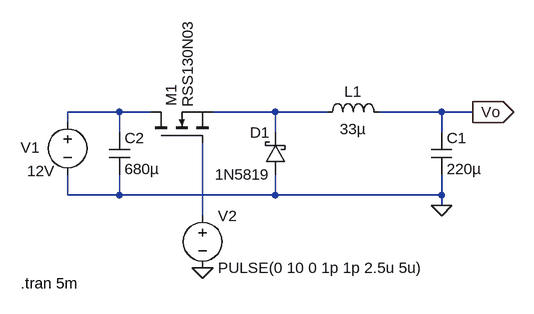
[diagram p0: schematic Open_Loop_Buck_Converter.asc]
Open_Loop_Buck_Converter.asc, the LTspice schematic file:
Version 4
SHEET 1 880 680
WIRE 112 112 32 112
WIRE 160 112 112 112
WIRE 352 112 256 112
WIRE 432 112 352 112
WIRE 608 112 512 112
WIRE 656 112 608 112
WIRE 32 128 32 112
WIRE 112 144 112 112
WIRE 352 144 352 112
WIRE 608 144 608 112
WIRE 32 240 32 208
WIRE 112 240 112 208
WIRE 112 240 32 240
WIRE 352 240 352 208
WIRE 352 240 112 240
WIRE 608 240 608 208
WIRE 608 240 352 240
WIRE 608 256 608 240
WIRE 240 272 240 160
FLAG 240 352 0
FLAG 656 112 Vo
IOPIN 656 112 Out
FLAG 608 256 0
SYMBOL ind 416 128 R270
WINDOW 0 32 56 VTop 2
WINDOW 3 5 56 VBottom 2
SYMATTR InstName L1
SYMATTR Value 33µ
SYMBOL cap 592 144 R0
SYMATTR InstName C1
SYMATTR Value 220µ
SYMBOL schottky 368 208 R180
WINDOW 0 24 64 Left 2
WINDOW 3 24 0 Left 2
SYMATTR InstName D1
SYMATTR Value 1N5819
SYMATTR Description Diode
SYMATTR Type diode
SYMBOL nmos 160 160 R270
WINDOW 3 55 57 Left 2
SYMATTR Value RSS130N03
SYMATTR InstName M1
SYMBOL voltage 32 112 R0
WINDOW 0 -72 55 Left 2
WINDOW 3 -62 91 Left 2
WINDOW 123 0 0 Left 0
WINDOW 39 0 0 Left 0
SYMATTR InstName V1
SYMATTR Value 12V
SYMBOL voltage 240 256 R0
WINDOW 123 0 0 Left 0
WINDOW 39 0 0 Left 0
SYMATTR InstName V2
SYMATTR Value PULSE(0 10 0 1p 1p 2.5u 5u)
SYMBOL cap 96 144 R0
SYMATTR InstName C2
SYMATTR Value 680µ
TEXT -40 376 Left 2 !.tran 5m

The netlist it stands for:
* Open_Loop_Buck_Converter.asc
L1 N002 Vo 33µ
C1 Vo 0 220µ
D1 0 N002 1N5819
M1 N001 N003 N002 N002 RSS130N03
V1 N001 0 12V
V2 N003 0 PULSE(0 10 0 1p 1p 2.5u 5u)
C2 N001 0 680µ
.model D D
.lib standard.dio
.model NMOS NMOS
.model PMOS PMOS
.lib standard.mos
.tran 5m
.backanno
.end